# Altium schematic sheet mcu-osc.SchDoc: MCU Oscillator
size Letter; CheckedBy: J. Brinton; CompanyName: Signal Laboratories, Inc.; DrawnBy: J. Brinton; Engineer: J. Brinton; Address1: 3479 Edison Way; Address2: Menlo Park CA 94025; Address3: +1 (877) 778-8435; Address4: siglabs.com; Revision: 1; SheetNumber: 38; SheetTotal: 49
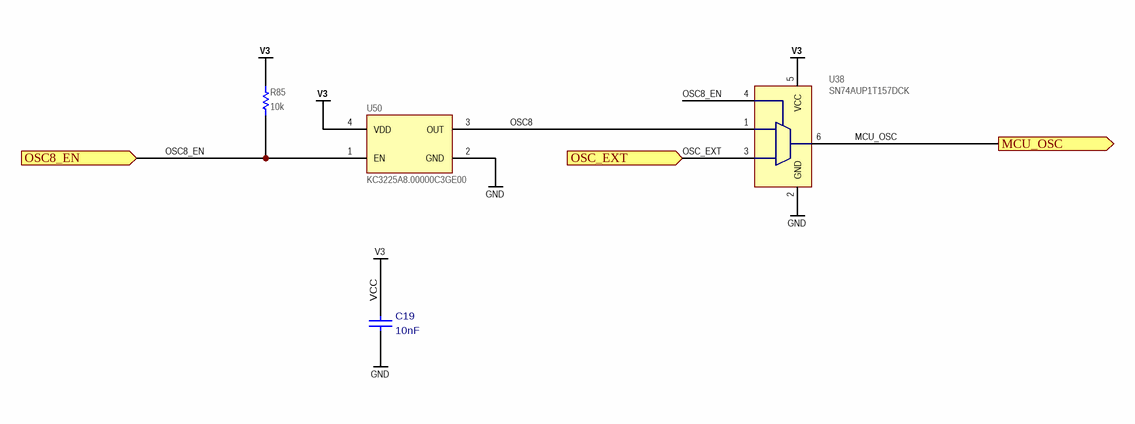
[diagram p0: mcu-osc.SchDoc]

## Parts
C19  value 10nF  [CAPC100X50X55L25N]  (hidden comment: GRM155R71H103KA88)
R85  value 10k  [RESC1005X40N]  (hidden comment: ERJ-2RKF1002X)
U38  SN74AUP1T157DCK  [SOT363]
U50  KC3225A8.00000C3GE00  [OSCCC320X250X80L75X100N]

## Ports
MCU_OSC (out), OSC8_EN (in), OSC_EXT (in)

## Nets
GND: C19.2 U38.2(GND) U50.2(GND)
VCC: C19.1 R85.2 U38.5(VCC) U50.4(VDD)  [also labelled V3]
MCU_OSC: U38.6(Y) ; port MCU_OSC
OSC8: U38.1(A) U50.3(OUT)
OSC8_EN: R85.1 U38.4(C) U50.1(EN) ; port OSC8_EN
OSC_EXT: U38.3(B) ; port OSC_EXT

## Notes on the sheet
- Title
- Engineer
- Revision
- Drawn By
- Checked By
- Date
- Sheet
- of

## Library data of the parts
C19 = TMK105B7103KV: Ceramic Capacitor 10nF ±10% 50V X7R 0402; Manufacturer: Murata; Tr: -55:125; Manufacturer P/N: GRM155R71H103KA88; Tolerance: ±10%; Package: 0402; Voltage: 50V
R85 = RES: Thick Film Resistor 10k ±1% 0.1W 50V 0402; Manufacturer: Panasonic; Tcr: ±100; Tr: -55:155; Voltage: 50; Power: 0.1; Manufacturer P/N: ERJ-2RKF1002X; Tolerance: ±1%; Alternatives: *; Footprint: *; Package: 0402
U38 = SN74AUP1T157DCK: Buffer Multiplexer; Manufacturer: Texas Instruments; Manufacturer P/N: SN74AUP1T157DCK
U50 = OSC_25M_NZ2520SB: Oscillator 8Mhz; Manufacturer: Kyocera; Manufacturer P/N: KC3225A8.00000C3GE00